# EAGLE design LPC800_TSSOP_breadboard (EAGLE 6.5.0)
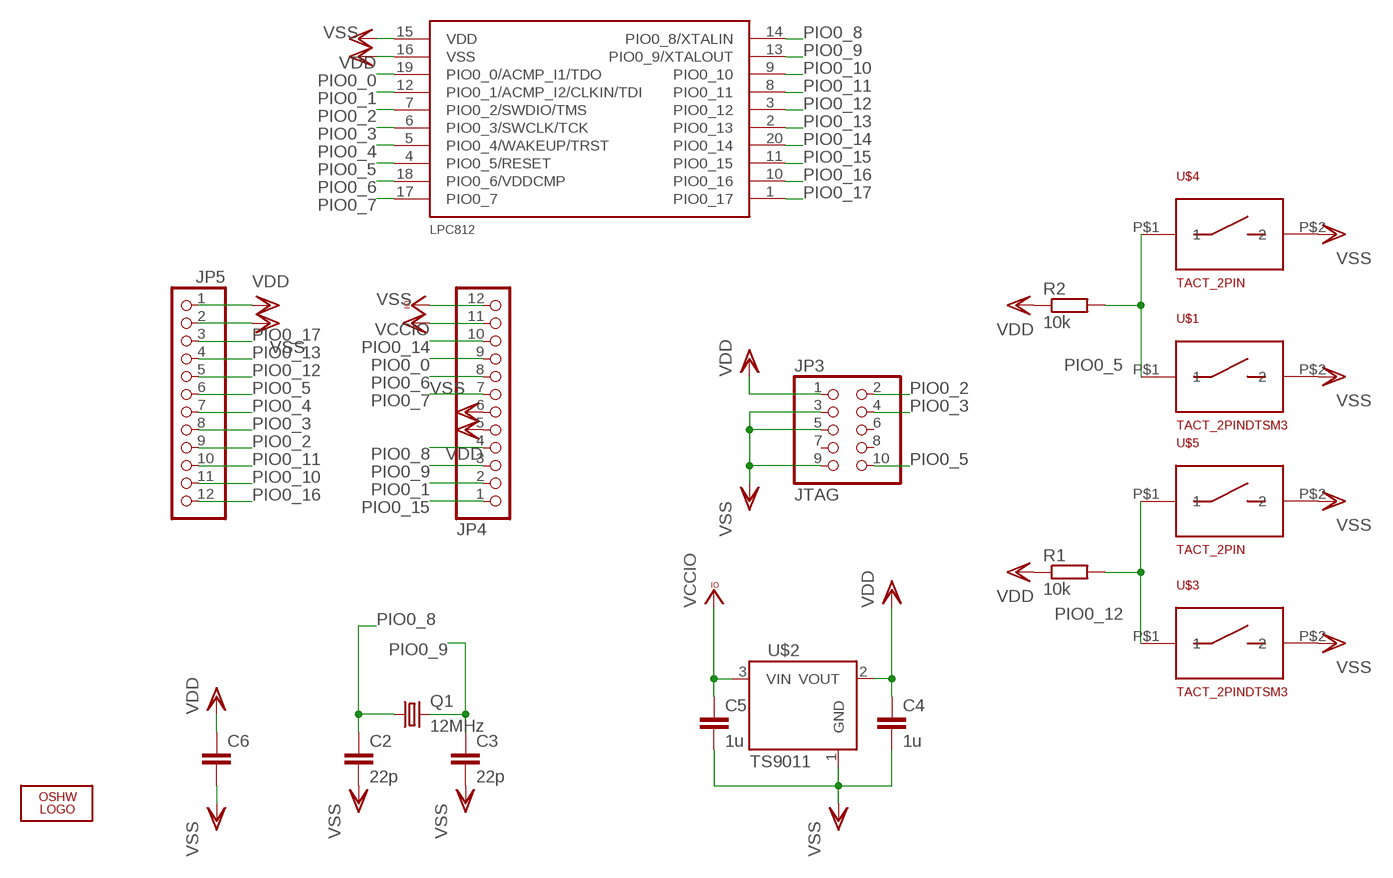
[diagram p0: schematic, sheet 1]

## Parts
C2  22p  C-EUC0603K  [C0603K]
C3  22p  C-EUC0603K  [C0603K]
C4  1u  C-EUC0805K  [C0805K]
C5  1u  C-EUC0805K  [C0805K]
C6  C-EUC0603K  [C0603K]
JP3  JTAG  PINHD-2X5SMD_1.27_SMD  [2X05_1.27_SMD]
JP4  PINHD-1X12NORM_OCT  [1X12_NORMAL_OCT]
JP5  PINHD-1X12NORM_OCT  [1X12_NORMAL_OCT]
LOGO2  OSHW_LOGO_FILLX0150-NT  [OSHW_FILLX150_NOTEXT]
LPC812  LPC812M101JDH20  [TSSOP20]
Q1  12MHz  CRYSTALSMD_5.0X3.2  [CRYSTAL_5.0X3.2]
R1  10k  R-EU_R0603  [R0603]
R2  10k  R-EU_R0603  [R0603]
U$1  TACT_2PINDTSM3  [DTSM3]
U$2  TS9011  [SOT23-3]
U$3  TACT_2PINDTSM3  [DTSM3]
U$4  TACT_2PIN  [TD-85XU]
U$5  TACT_2PIN  [TD-85XU]

## Nets
PIO0_0: JP4.9 LPC812.19(PIO0_0/ACMP_I1/TDO)
PIO0_1: JP4.2 LPC812.12(PIO0_1/ACMP_I2/CLKIN/TDI)
PIO0_2: JP3.2 JP5.9 LPC812.7(PIO0_2/SWDIO/TMS)
PIO0_3: JP3.4 JP5.8 LPC812.6(PIO0_3/SWCLK/TCK)
PIO0_4: JP5.7 LPC812.5(PIO0_4/WAKEUP/TRST)
PIO0_5: JP3.10 JP5.6 LPC812.4(PIO0_5/RESET) R2.2 U$1.P$1 U$4.P$1
PIO0_6: JP4.8 LPC812.18(PIO0_6/VDDCMP)
PIO0_7: JP4.7 LPC812.17(PIO0_7)
PIO0_8: C2.1 JP4.4 LPC812.14(PIO0_8/XTALIN) Q1.1
PIO0_9: C3.1 JP4.3 LPC812.13(PIO0_9/XTALOUT) Q1.2
PIO0_10: JP5.11 LPC812.9(PIO0_10)
PIO0_11: JP5.10 LPC812.8(PIO0_11)
PIO0_12: JP5.5 LPC812.3(PIO0_12) R1.2 U$3.P$1 U$5.P$1
PIO0_13: JP5.4 LPC812.2(PIO0_13)
PIO0_14: JP4.10 LPC812.20(PIO0_14)
PIO0_15: JP4.1 LPC812.11(PIO0_15)
PIO0_16: JP5.12 LPC812.10(PIO0_16)
PIO0_17: JP5.3 LPC812.1(PIO0_17)
VCCIO: C5.1 JP4.12 U$2.3(VIN)
VDD: C4.1 C6.1 JP3.1 JP4.5 JP5.1 LPC812.15(VDD) R1.1 R2.1 U$2.2(VOUT)
VSS: C2.2 C3.2 C4.2 C5.2 C6.2 JP3.3 JP3.5 JP3.9 JP4.6 JP4.11 JP5.2 LPC812.16(VSS) U$1.P$2 U$2.1(GND) U$3.P$2 U$4.P$2 U$5.P$2
Unconnected: JP3.6 JP3.7 JP3.8

## Library data of the parts
C2 C3 C6 = SquantorRCL:C-EU: CAPACITOR, European symbol
C4 C5 = bart_rcl:C-EU: CAPACITOR, European symbol
JP3 = SquantorConnectors:PINHD-2X5: PIN HEADER
JP4 JP5 = SquantorConnectors:PINHD-1X12: PIN HEADER
LOGO2 = ohw-logo:OSHW_LOGO_FILL
LPC812 = LPC800:LPC812M101JDH20
Q1 = bart_crystals:CRYSTAL: CRYSTAL
R1 R2 = bart_rcl:R-EU_: RESISTOR, European symbol
U$1 U$3-U$5 = SquantorButtons:TACT_2PIN
U$2 = bart_ic:TS9011

## Board
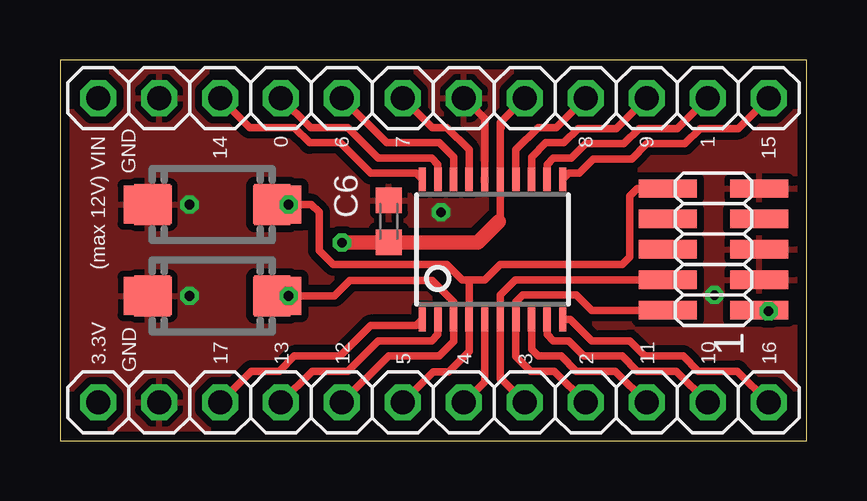
[diagram p1: board, top side]
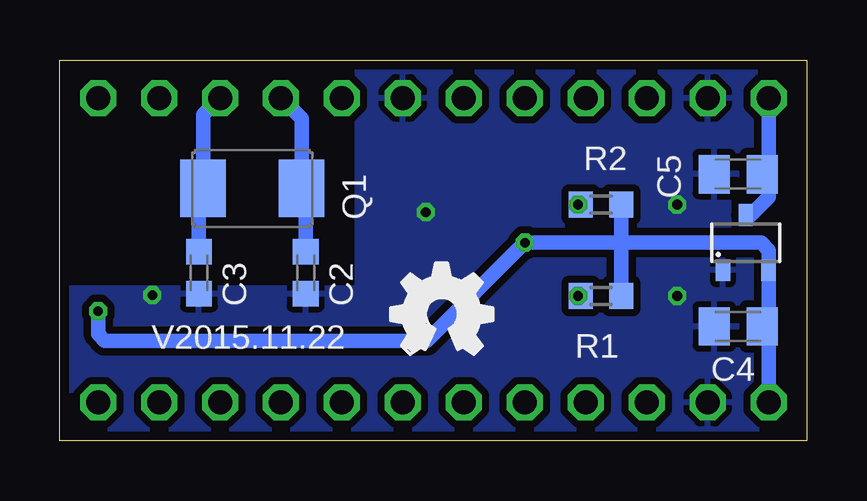
[diagram p2: board, bottom side, seen from below]

Size 31.11 x 15.88 mm. Coordinates in mm from the lower left corner, seen from the top.
Outline: 31.11,0 31.11,15.88 0,15.88 0,0 31.11,0
Copper layers (1*16): Top 0.0356mm / dielectric 1.5011mm / Bottom 0.0356mm
Design rules "OSHPark": minimum track width 6mil, minimum drill 13mil, track to track 6mil, track to pad 6mil, pad to pad 6mil, via to via 6mil, smd to smd 6mil, copper to edge 15mil, drill to drill 6mil, minimum pad ring 7mil, minimum via ring 7mil, stop-mask expansion 3mil, vias tented up to drill 0mil, thermal gap 10mil

### Footprints (pad centres in the part's own frame; a part is rotated, then mirrored left to right if it is on the bottom)
C0603K = smd 1.05 x 1.08: 1 -0.875,0; 2 0.875,0
C0805K = smd 1.3 x 1.6: 1 -1,0; 2 1,0
2X05_1.27_SMD = smd 0.76 x 2.4: 1 -2.54,-1.905; 2 -2.54,1.905; 3 -1.27,-1.905; 4 -1.27,1.905; 5 0,-1.905; 6 0,1.905; 7 1.27,-1.905; 8 1.27,1.905; 9 2.54,-1.905; 10 2.54,1.905
1X12_NORMAL_OCT = drill 1 octagon: 1 -13.97,0; 2 -11.43,0; 3 -8.89,0; 4 -6.35,0; 5 -3.81,0; 6 -1.27,0; 7 1.27,0; 8 3.81,0; 9 6.35,0; 10 8.89,0; 11 11.43,0; 12 13.97,0
TSSOP20 = smd 0.305 x 0.991: 1 -2.925,-2.918; 2 -2.275,-2.918; 3 -1.625,-2.918; 4 -0.975,-2.918; 5 -0.325,-2.918; 6 0.325,-2.918; 7 0.975,-2.918; 8 1.625,-2.918; 9 2.275,-2.918; 10 2.925,-2.918; 11 2.925,2.918; 12 2.275,2.918; 13 1.625,2.918; 14 0.975,2.918; 15 0.325,2.918; 16 -0.325,2.918; 17 -0.975,2.918; 18 -1.625,2.918; 19 -2.275,2.918; 20 -2.925,2.918
CRYSTAL_5.0X3.2 = smd 1.9 x 2.4: 1 -2.05,0; 2 2.05,0
R0603 = smd 1 x 1.1: 1 -0.85,0; 2 0.85,0
DTSM3 = smd 2 x 1.6: P$1 -2.7,0; P$2 2.7,0
SOT23-3 = smd 0.6 x 0.9: 1 -0.95,-1.15; 2 0.95,-1.15; 3 0,1.15
TD-85XU = smd 1.5 x 1.7: P$1 -2.5,0; P$2 2.5,0

### Placement (x,y rotation side)
C2  20.88,7 270 bottom
C3  25.32,7 270 bottom
C4  2.86,4.76 180 bottom
C5  2.86,11.11 180 bottom
C6  13.7,9.14 90 top
JP3  27.23,7.98 90 top
JP4  15.56,14.29 180 top
JP5  15.56,1.59 0 top
LOGO2  17.34,3.59 0 bottom
LPC812  18.02,7.98 0 top
Q1  23.1,10.52 180 bottom
R1  8.57,6.03 180 bottom
R2  8.57,9.84 180 bottom
U$1  6.35,9.84 180 top
U$2  2.54,8.26 0 bottom
U$3  6.35,6.03 180 top
U$4  6.35,9.84 180 top
U$5  6.35,6.03 180 top

### Tracks (layer width: path | path; a pad name or v marks a point on that pad's centre or on a via)
PIO0_0
  Top 0.305: LPC812.19 15.75,11.52 15.48,11.79 13.26,11.79 11.99,13.06 10.44,13.06 JP4.9
PIO0_1
  Top 0.305: LPC812.12 20.3,11.52 20.56,11.79 21.31,11.79 21.91,12.38 23.5,12.38 24.13,13.02 25.72,13.02 JP4.2
PIO0_2
  Top 0.305: JP3.2 22.15,5.44 21.51,6.07 19.29,6.07 19,5.78 LPC812.7 19,3.51 19.61,2.9 20.6,2.9 JP5.9
PIO0_3
  Top 0.305: JP3.4 18.97,6.71 18.34,6.07 18.34,5.07 LPC812.6 18.35,2.57 18.38,2.57 JP5.8
PIO0_4
  Top 0.305: LPC812.5 17.7,2.46 JP5.7
PIO0_5  (via drill 0.4)
  Top 0.305: JP3.10 24.05,10.52 23.74,10.2 23.74,7.66 23.42,7.34 18.34,7.34 17.7,6.71 17.07,6.71 | 17.07,6.71 17.05,6.68 LPC812.4 17.05,3.71 16.19,2.86 15.56,2.86 JP5.6 | 17.07,6.71 16.75,6.71 16.12,7.34 11.39,7.34 10.79,7.94 10.79,9.53 10.48,9.84 v9.53,9.84 U$1.P$1 U$4.P$1
  Bottom 0.305: R2.2 v9.53,9.84
PIO0_6
  Top 0.305: LPC812.18 16.4,11.82 15.8,12.42 13.61,12.42 JP4.8
PIO0_7
  Top 0.305: LPC812.17 17.05,12.13 16.12,13.06 15.52,13.06 JP4.7
PIO0_8
  Top 0.305: LPC812.14 19,12.13 19.93,13.06 20.68,13.06 JP4.4
  Bottom 0.61: C2.1 20.88,10.98 Q1.1 21.05,13.43 JP4.4
PIO0_9
  Top 0.305: LPC812.13 19.65,11.82 20.24,12.42 20.99,12.42 21.59,13.02 23.18,13.02 JP4.3
  Bottom 0.61: C3.1 25.32,10.98 Q1.2 25.15,13.58 JP4.3
PIO0_10
  Top 0.305: LPC812.9 20.3,4.43 20.56,4.17 21.2,4.17 21.83,3.53 23.42,3.53 24.05,2.9 25.68,2.9 JP5.11
PIO0_11
  Top 0.305: LPC812.8 19.65,3.81 19.93,3.53 20.88,3.53 21.51,2.9 23.14,2.9 JP5.10
PIO0_12  (via drill 0.4)
  Top 0.305: JP5.5 13.69,3.53 15.8,3.53 16.4,4.13 LPC812.3 16.4,5.79 15.52,6.67 12.06,6.67 11.43,6.03 v9.53,6.03 U$3.P$1 U$5.P$1
  Bottom 0.305: v9.53,6.03 R1.2
PIO0_13
  Top 0.305: LPC812.2 15.75,4.43 15.48,4.17 13.26,4.17 11.99,2.9 10.52,2.9 JP5.4
PIO0_14
  Top 0.305: LPC812.20 14.85,11.15 12.94,11.15 11.67,12.42 10.4,12.42 9.77,13.06 7.9,13.06 JP4.10
PIO0_15
  Top 0.305: LPC812.11 21.2,11.15 21.63,11.15 22.23,11.75 23.81,11.75 24.45,12.38 26.04,12.38 26.67,13.02 28.26,13.02 JP4.1
PIO0_16
  Top 0.305: LPC812.10 21.26,5.06 22.15,4.17 23.74,4.17 24.37,3.53 25.96,3.53 26.59,2.9 28.22,2.9 JP5.12
PIO0_17
  Top 0.305: LPC812.1 14.85,4.8 12.94,4.8 11.67,3.53 9.77,3.53 9.13,2.9 7.98,2.9 JP5.3
VCCIO
  Bottom 0.61: JP4.12 1.59,11.11 | C5.1 1.59,11.11 | 1.59,11.11 1.59,10.16 2.38,9.37 U$2.3
VDD  (via drill 0.4)
  Top 0.305: 18.34,10.89 LPC812.15 | 18.27,9.14 18.35,9.21 LPC812.15 | LPC812.15 18.35,13.02 | 18.35,13.02 18.35,13.27 JP4.5 | 18.38,13.06 18.35,13.02
  Top 0.61: 18.27,9.14 17.4,8.27 C6.1 13.7,8.26 v11.75,8.26 | v29.53,5.4 29.17,5.4 JP3.1
  Bottom 0.61: JP5.1 1.59,5.08 | 1.59,5.08 1.59,7.7 U$2.2 1.59,7.78 1.59,7.94 1.91,8.26 7.72,8.26 | C4.1 1.59,5.08 | R1.1 7.72,8.26 | 7.72,8.26 R2.1 | 7.72,8.26 v11.75,8.26 15.84,4.17 29.25,4.17 29.53,4.45 v29.53,5.4
VSS  (via drill 0.4)
  Top 0.305: LPC812.16 17.7,13.02 | 17.7,13.02 17.7,13.42 JP4.6 | 17.66,13.06 17.7,13.02
  other vias: 27.27,6.07 15.88,9.53 5.4,9.84 5.4,6.03
  pour Top (isolate 0.305): 0,15.88 31.11,15.88 31.11,0 0,0
  pour Bottom (isolate 0.305): 0,15.88 18.73,15.88 18.73,6.35 31.08,6.35 31.11,0 0,0

### Text on the board
bPlace: V2015.11.22
tNames: (max 12V) VIN | GND | 14 | 0 | 6 | 7 | 8 | 9 | 1 | 15 | 3.3V | GND | 17 | 13 | 12 | 5 | 4 | 3 | 2 | 11 | 10 | 16